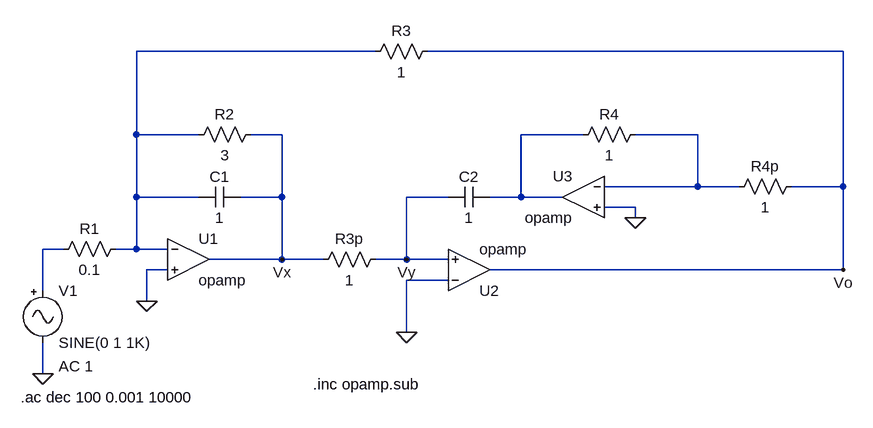
[diagram p0: schematic Circuito Pasabajos.asc]
Circuito Pasabajos.asc, the LTspice schematic file:
Version 4
SHEET 1 1136 680
WIRE 384 -144 16 -144
WIRE 1104 -144 464 -144
WIRE 16 -16 16 -144
WIRE 112 -16 16 -16
WIRE 240 -16 192 -16
WIRE 704 -16 608 -16
WIRE 880 -16 784 -16
WIRE 880 64 880 -16
WIRE 880 64 736 64
WIRE 944 64 880 64
WIRE 1104 64 1104 -144
WIRE 1104 64 1024 64
WIRE 16 80 16 -16
WIRE 112 80 16 80
WIRE 240 80 240 -16
WIRE 240 80 176 80
WIRE 496 80 432 80
WIRE 608 80 608 -16
WIRE 608 80 560 80
WIRE 672 80 608 80
WIRE 784 96 736 96
WIRE 784 112 784 96
WIRE -96 160 -128 160
WIRE 16 160 16 80
WIRE 16 160 -16 160
WIRE 64 160 16 160
WIRE 240 176 240 80
WIRE 240 176 128 176
WIRE 304 176 240 176
WIRE 432 176 432 80
WIRE 432 176 384 176
WIRE 496 176 432 176
WIRE 64 192 32 192
WIRE 1104 192 1104 64
WIRE 1104 192 560 192
WIRE 496 208 432 208
WIRE -128 224 -128 160
WIRE 32 240 32 192
WIRE 432 288 432 208
WIRE -128 352 -128 304
FLAG -128 352 0
FLAG 32 240 0
FLAG 432 288 0
FLAG 432 176 Vy
FLAG 784 112 0
FLAG 240 176 Vx
FLAG 1104 192 Vo
SYMBOL OpAmps\\opamp 96 112 R0
SYMATTR InstName U1
SYMBOL OpAmps\\opamp 528 256 M180
SYMATTR InstName U2
SYMBOL Misc\\signal -128 208 R0
WINDOW 123 24 132 Left 2
WINDOW 39 0 0 Left 0
SYMATTR InstName V1
SYMATTR Value2 AC 1
SYMBOL res 0 144 R90
WINDOW 0 0 56 VBottom 2
WINDOW 3 32 56 VTop 2
SYMATTR InstName R1
SYMATTR Value 0.1
SYMBOL cap 176 64 R90
WINDOW 0 0 32 VBottom 2
WINDOW 3 32 32 VTop 2
SYMATTR InstName C1
SYMATTR Value 1
SYMBOL res 208 -32 R90
WINDOW 0 0 56 VBottom 2
WINDOW 3 32 56 VTop 2
SYMATTR InstName R2
SYMATTR Value 3
SYMBOL res 400 160 R90
WINDOW 0 0 56 VBottom 2
WINDOW 3 32 56 VTop 2
SYMATTR InstName R3p
SYMATTR Value 1
SYMBOL cap 560 64 R90
WINDOW 0 0 32 VBottom 2
WINDOW 3 32 32 VTop 2
SYMATTR InstName C2
SYMATTR Value 1
SYMBOL OpAmps\\opamp 704 16 M0
SYMATTR InstName U3
SYMBOL res 800 -32 R90
WINDOW 0 0 56 VBottom 2
WINDOW 3 32 56 VTop 2
SYMATTR InstName R4
SYMATTR Value 1
SYMBOL res 1040 48 R90
WINDOW 0 0 56 VBottom 2
WINDOW 3 32 56 VTop 2
SYMATTR InstName R4p
SYMATTR Value 1
SYMBOL res 480 -160 R90
WINDOW 0 0 56 VBottom 2
WINDOW 3 32 56 VTop 2
SYMATTR InstName R3
SYMATTR Value 1
TEXT 288 368 Left 2 !.inc opamp.sub
TEXT -162 388 Left 2 !.ac dec 100 0.001 10000

The netlist it stands for:
* Circuito Pasabajos.asc
XU1 N001 0 Vx opamp Aol=100K GBW=10Meg  ; pins invin noninvin out
XU2 0 Vy Vo opamp Aol=100K GBW=10Meg  ; pins invin noninvin out
V1 N004 0 SINE(0 1 1K) AC 1
R1 N001 N004 0.1
C1 Vx N001 1
R2 Vx N001 3
R3p Vy Vx 1
C2 N002 Vy 1
XU3 N003 0 N002 opamp Aol=100K GBW=10Meg  ; pins invin noninvin out
R4 N003 N002 1
R4p Vo N003 1
R3 Vo N001 1
.inc opamp.sub
.ac dec 100 0.001 10000
.backanno
.end